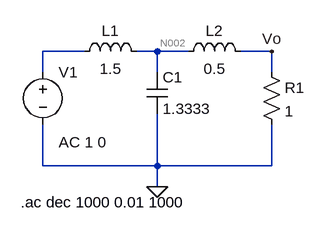
[diagram p0: schematic EJ1.asc]
EJ1.asc, the LTspice schematic file:
Version 4
SHEET 1 880 680
WIRE 112 80 48 80
WIRE 224 80 192 80
WIRE 272 80 224 80
WIRE 400 80 352 80
WIRE 48 112 48 80
WIRE 224 112 224 80
WIRE 400 112 400 80
WIRE 48 256 48 192
WIRE 224 256 224 176
WIRE 224 256 48 256
WIRE 400 256 400 192
WIRE 400 256 224 256
WIRE 224 288 224 256
FLAG 224 288 0
FLAG 400 80 Vo
SYMBOL voltage 48 96 R0
WINDOW 123 24 124 Left 2
WINDOW 39 0 0 Left 0
SYMATTR InstName V1
SYMATTR Value ""
SYMATTR Value2 AC 1 0
SYMBOL ind 96 96 R270
WINDOW 0 32 56 VTop 2
WINDOW 3 5 56 VBottom 2
SYMATTR InstName L1
SYMATTR Value 1.5
SYMBOL ind 256 96 R270
WINDOW 0 32 56 VTop 2
WINDOW 3 5 56 VBottom 2
SYMATTR InstName L2
SYMATTR Value 0.5
SYMBOL cap 208 112 R0
SYMATTR InstName C1
SYMATTR Value 1.3333
SYMBOL res 384 96 R0
SYMATTR InstName R1
SYMATTR Value 1
TEXT 14 312 Left 2 !.ac dec 1000 0.01 1000

The netlist it stands for:
* EJ1.asc
V1 N001 0 AC 1 0
L1 N001 N002 1.5
L2 N002 Vo 0.5
C1 N002 0 1.3333
R1 Vo 0 1
.ac dec 1000 0.01 1000
.backanno
.end

* Results of the author's LTspice run, read from the files saved beside the schematic
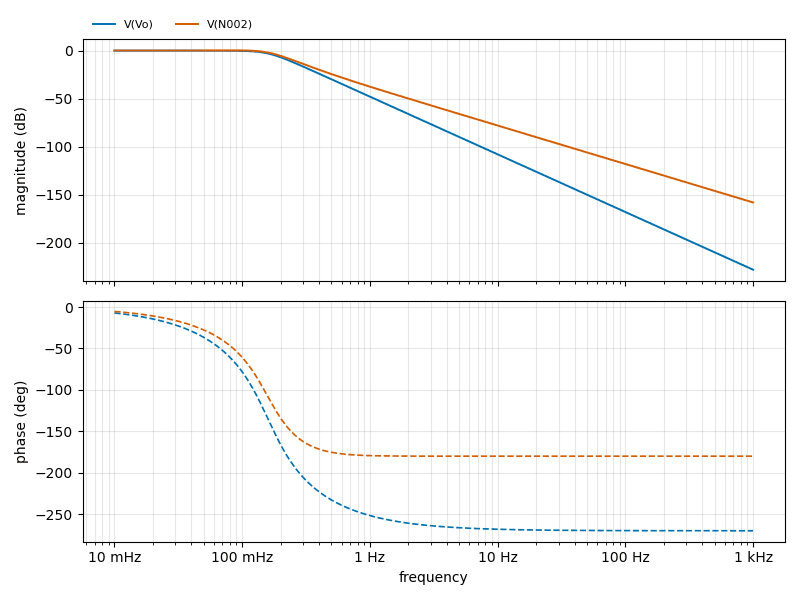
[diagram p1: AC Analysis of EJ1.asc, plotted from the saved traces]
* AC Analysis, 1 run:
*   V(Vo): -0.02 dB at 10 mHz, -227.89 dB at 1 kHz, peak -0.02 dB at 35.16 mHz, 3 dB below the peak at 159.2 mHz
*   V(N002): -0.00 dB at 10 mHz, -157.95 dB at 1 kHz, peak 0.20 dB at 84.92 mHz, 3 dB below the peak at 169.3 mHz